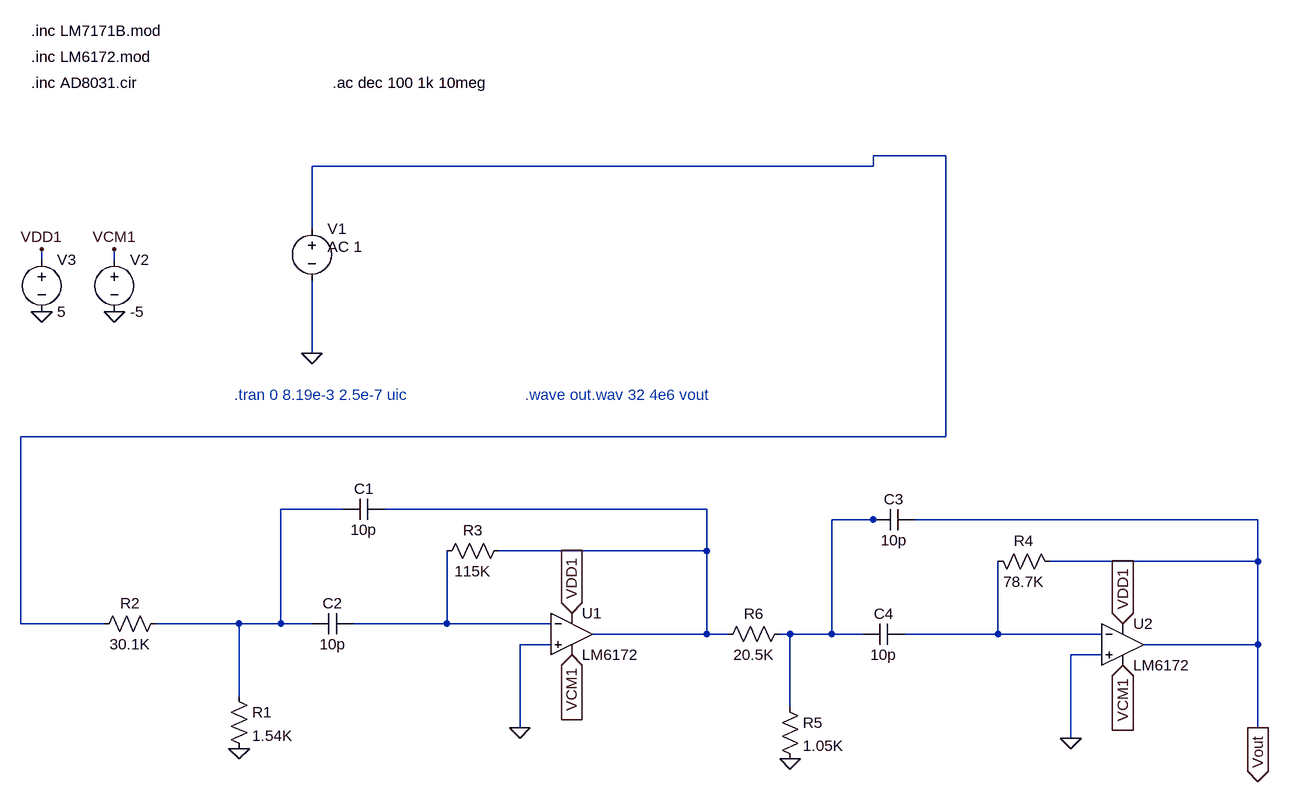
[diagram p0: schematic Xdb-150-630bw-2stage-4order-Bandpass.asc]
Xdb-150-630bw-2stage-4order-Bandpass.asc, the LTspice schematic file:
Version 4
SHEET 1 2036 680
WIRE 1280 -576 1168 -576
WIRE 1168 -560 1168 -576
WIRE 1168 -560 304 -560
WIRE 304 -464 304 -560
WIRE -112 -416 -112 -432
WIRE 0 -416 0 -432
WIRE 304 -272 304 -384
WIRE 1280 -144 1280 -576
WIRE 1280 -144 -144 -144
WIRE 352 -32 256 -32
WIRE 912 -32 416 -32
WIRE 1168 -16 1104 -16
WIRE 1184 -16 1168 -16
WIRE 1760 -16 1232 -16
WIRE 912 32 912 -32
WIRE 912 32 592 32
WIRE 1760 48 1760 -16
WIRE 1760 48 1440 48
WIRE -144 144 -144 -144
WIRE -16 144 -144 144
WIRE 192 144 64 144
WIRE 256 144 256 -32
WIRE 256 144 192 144
WIRE 304 144 256 144
WIRE 512 144 512 32
WIRE 512 144 368 144
WIRE 672 144 512 144
WIRE 912 160 912 32
WIRE 912 160 736 160
WIRE 944 160 912 160
WIRE 1040 160 1024 160
WIRE 1104 160 1104 -16
WIRE 1104 160 1040 160
WIRE 1152 160 1104 160
WIRE 1360 160 1360 48
WIRE 1360 160 1216 160
WIRE 1520 160 1360 160
WIRE 672 176 624 176
WIRE 1760 176 1760 48
WIRE 1760 176 1584 176
WIRE 1520 192 1472 192
WIRE 192 256 192 144
WIRE 1040 272 1040 160
WIRE 624 304 624 176
WIRE 1760 304 1760 176
WIRE 1472 320 1472 192
FLAG 624 304 0
FLAG 704 128 VDD1
IOPIN 704 128 In
FLAG 704 192 VCM1
IOPIN 704 192 In
FLAG -112 -336 0
FLAG 0 -336 0
FLAG -112 -432 VDD1
FLAG 0 -432 VCM1
FLAG 1472 320 0
FLAG 1552 144 VDD1
IOPIN 1552 144 In
FLAG 1552 208 VCM1
IOPIN 1552 208 In
FLAG 1760 304 Vout
IOPIN 1760 304 Out
FLAG 304 -272 0
FLAG 192 336 0
FLAG 1040 352 0
SYMBOL res 80 128 R90
WINDOW 0 0 56 VBottom 2
WINDOW 3 32 56 VTop 2
SYMATTR InstName R2
SYMATTR Value 30.1K
SYMBOL voltage 0 -432 R0
WINDOW 123 0 0 Left 0
WINDOW 39 0 0 Left 0
SYMATTR InstName V2
SYMATTR Value -5
SYMBOL OpAmps\\opamp2 704 96 R0
SYMATTR InstName U1
SYMATTR Value LM6172
SYMBOL voltage -112 -432 R0
WINDOW 123 0 0 Left 0
WINDOW 39 0 0 Left 0
SYMATTR InstName V3
SYMATTR Value 5
SYMBOL OpAmps\\opamp2 1552 112 R0
SYMATTR InstName U2
SYMATTR Value LM6172
SYMBOL voltage 304 -480 R0
WINDOW 3 24 72 Left 2
WINDOW 123 24 44 Left 2
WINDOW 39 24 72 Left 2
SYMATTR Value ""
SYMATTR Value2 AC 1
SYMATTR InstName V1
SYMBOL cap 416 -48 R90
WINDOW 0 0 32 VBottom 2
WINDOW 3 32 32 VTop 2
SYMATTR InstName C1
SYMATTR Value 10p
SYMBOL cap 368 128 R90
WINDOW 0 0 32 VBottom 2
WINDOW 3 32 32 VTop 2
SYMATTR InstName C2
SYMATTR Value 10p
SYMBOL cap 1216 144 R90
WINDOW 0 0 32 VBottom 2
WINDOW 3 32 32 VTop 2
SYMATTR InstName C4
SYMATTR Value 10p
SYMBOL cap 1232 -32 R90
WINDOW 0 0 32 VBottom 2
WINDOW 3 32 32 VTop 2
SYMATTR InstName C3
SYMATTR Value 10p
SYMBOL res 176 240 R0
SYMATTR InstName R1
SYMATTR Value 1.54K
SYMBOL res 608 16 R90
WINDOW 0 0 56 VBottom 2
WINDOW 3 32 56 VTop 2
SYMATTR InstName R3
SYMATTR Value 115K
SYMBOL res 1456 64 M270
WINDOW 0 32 56 VTop 2
WINDOW 3 0 56 VBottom 2
SYMATTR InstName R4
SYMATTR Value 78.7K
SYMBOL res 1024 256 R0
SYMATTR InstName R5
SYMATTR Value 1.05K
SYMBOL res 1040 144 R90
WINDOW 0 0 56 VBottom 2
WINDOW 3 32 56 VTop 2
SYMATTR InstName R6
SYMATTR Value 20.5K
TEXT -128 -768 Left 2 !.inc LM7171B.mod
TEXT -128 -728 Left 2 !.inc LM6172.mod
TEXT -128 -688 Left 2 !.inc AD8031.cir
TEXT 184 -208 Left 2 ;.tran 0 8.19e-3 2.5e-7 uic
TEXT 632 -208 Left 2 ;.wave out.wav 32 4e6 vout
TEXT 336 -688 Left 2 !.ac dec 100 1k 10meg

The netlist it stands for:
* Xdb-150-630bw-2stage-4order-Bandpass.asc
R2 N002 N001 30.1K
V2 VCM1 0 -5
XU1 0 N005 VDD1 VCM1 N003 LM6172  ; pins In+ In- V+ V- OUT
V3 VDD1 0 5
XU2 0 N006 VDD1 VCM1 Vout LM6172  ; pins In+ In- V+ V- OUT
V1 N001 0 AC 1
C1 N003 N002 10p
C2 N005 N002 10p
C4 N006 N004 10p
C3 Vout N004 10p
R1 N002 0 1.54K
R3 N003 N005 115K
R4 Vout N006 78.7K
R5 N004 0 1.05K
R6 N004 N003 20.5K
.inc LM7171B.mod
.inc LM6172.mod
.inc AD8031.cir
* .tran 0 8.19e-3 2.5e-7 uic
* .wave out.wav 32 4e6 vout
.ac dec 100 1k 10meg
.backanno
.end